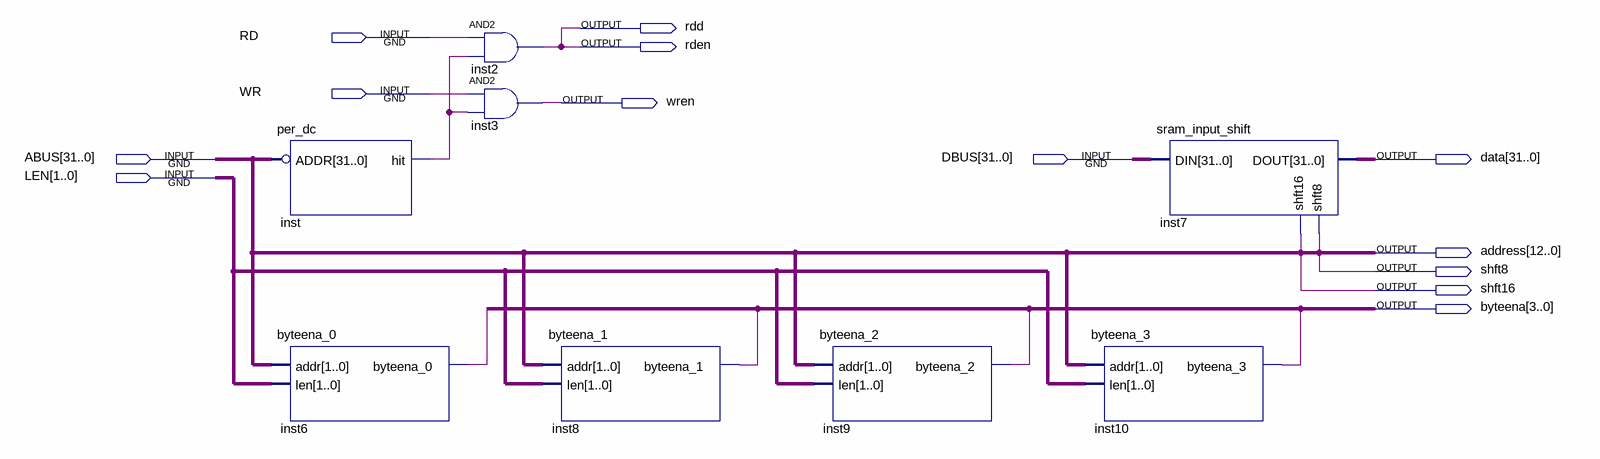
[diagram p0: schematic sheet]
// Quartus schematic sramif.bdf as structural Verilog: 8 symbols, 13 pins
module sramif (
  input  RD,
  input  WR,
  input  [31:0] ABUS,
  input  [31:0] DBUS,
  input  [1:0] LEN,
  output rdd,
  output rden,
  output wren,
  output [31:0] data,
  output [12:0] address,
  output shft8,
  output shft16,
  output [3:0] byteena
);

  wire inst_hit;

  per_dc inst (.ADDR(ABUS ^ 32'hffff0000), .hit(inst_hit));
  byteena_0 inst6 (.addr(ABUS[1:0]), .len(LEN), .byteena_0(byteena[0]));
  and inst2 (rdd, RD, inst_hit);
  and inst3 (wren, WR, inst_hit);
  byteena_1 inst8 (.addr(ABUS[1:0]), .len(LEN), .byteena_1(byteena[1]));
  byteena_2 inst9 (.addr(ABUS[1:0]), .len(LEN), .byteena_2(byteena[2]));
  byteena_3 inst10 (.addr(ABUS[1:0]), .len(LEN), .byteena_3(byteena[3]));
  sram_input_shift inst7 (.shft16(ABUS[1]), .DIN(DBUS), .shft8(ABUS[0]), .DOUT(data));

  assign address = ABUS[14:2];
  assign rden = rdd;
  assign shft8 = ABUS[0];
  assign shft16 = ABUS[1];

  // Other names for the same wires on the sheet: ADDR[31:0] = ABUS
endmodule
